# Altium project forwardConverterPCB.PrjPcb (part 2 of 22)
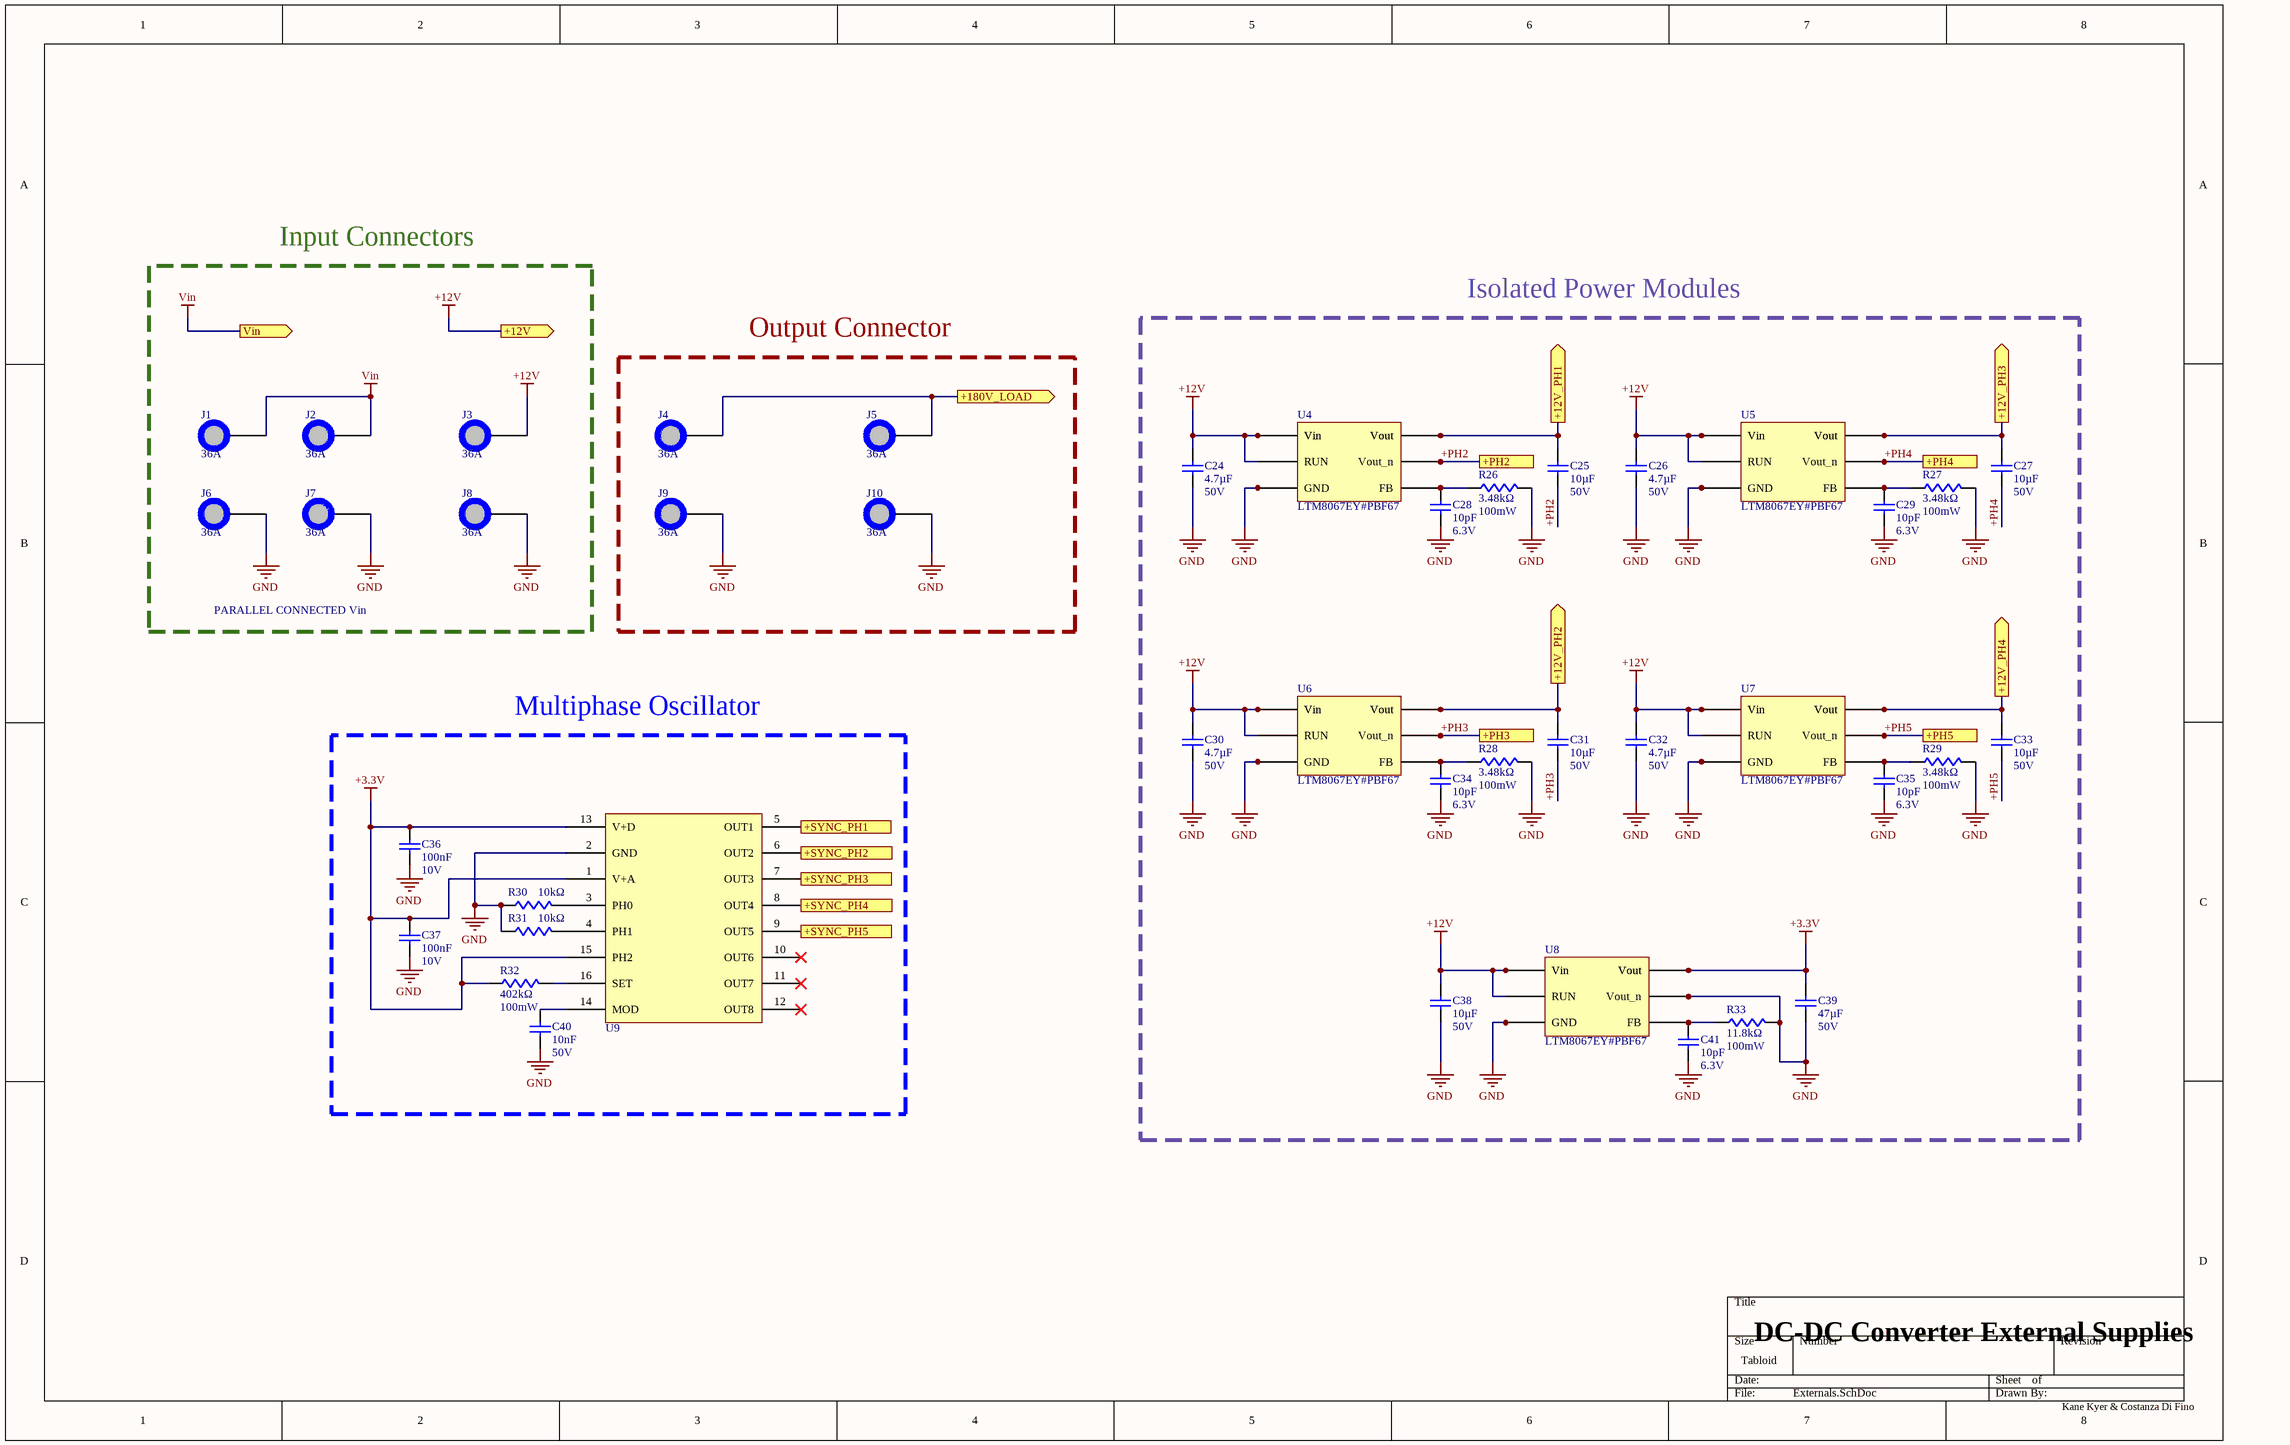
[diagram p7: Externals.SchDoc]

## Sheet Externals.SchDoc (continued)

### Library data of the parts
C24 C26 C30 C32 = GMC31X7R475K50NT: Ceramic Capacitor, Multilayer, Ceramic, 50V, 10% +Tol, 10% -Tol, X7R, 15% TC, 4.7uF, Surface Mount, 1206; Manufacturer: Cal-Chip Electronics; Supplier: DigiKey; Supplier Part Number: 4713-GMC31X7R475K50NTCT-ND; Manufacturer Part Number: GMC31X7R475K50NT; RoHS: Compliant; Category: Ceramic Capacitors; Stock: 34176; Pricing: 1=0.3, 10=0.176, 50=0.128, 100=0.1133, 500=0.08864, 1000=0.08105 (USD); China RoHS: Compliant; Country of Origin: Slovenia, South Korea, Taiwan; Dielectric Material: Ceramic; Export Control Classification Number (ECCN) Code: EAR99; Height: 1.9mm; Harmonized Tariff Schedule (HTS) Code: 8532.24.00.20; Introduction Date: 2018-03-20; Length: 3.2mm; Lifecycle Status: Production; Max Operating Temperature: 125°C; Min Operating Temperature: -55°C; Mounting Technology: Surface Mount; Number of Terminals: 2; REACH SVHC: Yes; Width: 1.6mm; ComponentLink1URL: https://datasheet.octopart.com:443/GMC31X7R475K50NT-Cal-Chip-Electronics-datasheet-182028815.pdf?src-supplier=IHS; ComponentLink1Description: https://datasheet.octopart.com:443/GMC31X7R475K50NT-Cal-Chip-Electronics-datasheet-182028815.pdf?src-supplier=IHS
C25 C27 C31 C33 C38 = CL31B106KBHNNNE: 50V 10uF X7R ±10% 1206 Multilayer Ceramic Capacitors MLCC - SMD/SMT ROHS; Manufacturer: Samsung Electro-Mechanics; Supplier: DigiKey; Supplier Part Number: 1276-6767-1-ND; Manufacturer Part Number: CL31B106KBHNNNE; RoHS: Compliant; Category: Ceramic Capacitors; Stock: 3803783; Pricing: 1=0.35, 10=0.21, 50=0.1536, 100=0.1364, 500=0.10736, 1000=0.09841, 2000=0.09105, 4000=0.085, 6000=0.08196, 10000=0.07861, 14000=0.07664, 20000=0.07476, 24000=0.07386, 48000=0.07085, 50000=0.07069 (USD); Case/Package: 1206; Case Code (Imperial): 1206; Case Code (Metric): 3216; China RoHS: Compliant; Country of Origin: Mainland China, Philippines, South Korea; Dielectric: X7R; Dielectric Material: Ceramic; Export Control Classification Number (ECCN) Code: EAR99; Height: 1.8mm; Harmonized Tariff Schedule (HTS) Code: 8532.24.00.20; Introduction Date: 2014-09-18; Lead Free: Lead Free; Length: 3.2mm; Lifecycle Status: Production; Material: Ceramic; Max Operating Temperature: 125°C; Min Operating Temperature: -55°C; Mounting Technology: Surface Mount; Number of Terminals: 2; Packaging: Tape & Reel (TR); REACH SVHC: Yes; Schedule B: 8532240020, 8532240020|8532240020|8532240020|8532240020|8532240020; Thickness: 1.8034mm; Tolerance: 10%; Voltage Rating (DC): 50V; Width: 1.6mm; ComponentLink1URL: https://datasheet.octopart.com:443/CL31B106KBHNNNE-Samsung-Electro-Mechanics-datasheet-137256395.pdf?src-supplier=Upverter; ComponentLink1Description: https://datasheet.octopart.com:443/CL31B106KBHNNNE-Samsung-Electro-Mechanics-datasheet-137256395.pdf?src-supplier=Upverter; ComponentLink2URL: https://datasheet.octopart.com:443/CL31B106KBHNNNE-Samsung-Electro-Mechanics-datasheet-149066874.pdf?src-supplier=Future+Electronics; ComponentLink2Description: https://datasheet.octopart.com:443/CL31B106KBHNNNE-Samsung-Electro-Mechanics-datasheet-149066874.pdf?src-supplier=Future+Electronics; ComponentLink3URL: https://datasheet.octopart.com:443/CL31B106KBHNNNE-Samsung-Electro-Mechanics-datasheet-67374631.pdf?src-supplier=Future+Electronics; ComponentLink3Description: https://datasheet.octopart.com:443/CL31B106KBHNNNE-Samsung-Electro-Mechanics-datasheet-67374631.pdf?src-supplier=Future+Electronics; ComponentLink4URL: https://datasheet.octopart.com:443/CL31B106KBHNNNE-Samsung-Electro-Mechanics-datasheet-136482622.pdf?src-supplier=Newark; ComponentLink4Description: https://datasheet.octopart.com:443/CL31B106KBHNNNE-Samsung-Electro-Mechanics-datasheet-136482622.pdf?src-supplier=Newark; ComponentLink5URL: https://datasheet.octopart.com/CL31B106KBHNNNE-Samsung-Electro-Mechanics-datasheet-97040617.pdf; ComponentLink5Description: https://datasheet.octopart.com/CL31B106KBHNNNE-Samsung-Electro-Mechanics-datasheet-97040617.pdf; ComponentLink6URL: https://datasheet.octopart.com/CL31B106KBHNNNE-Samsung-Electro-Mechanics-datasheet-8324245.pdf; ComponentLink6Description: https://datasheet.octopart.com/CL31B106KBHNNNE-Samsung-Electro-Mechanics-datasheet-8324245.pdf; ComponentLink7URL: https://datasheet.octopart.com:443/CL31B106KBHNNNE-Samsung-Electro-Mechanics-datasheet-110617700.pdf?src-supplier=LCSC; ComponentLink7Description: https://datasheet.octopart.com:443/CL31B106KBHNNNE-Samsung-Electro-Mechanics-datasheet-110617700.pdf?src-supplier=LCSC; ComponentLink8URL: https://datasheet.octopart.com:443/CL31B106KBHNNNE-Samsung-datasheet-59220082.pdf?src-supplier=TME; ComponentLink8Description: https://datasheet.octopart.com:443/CL31B106KBHNNNE-Samsung-datasheet-59220082.pdf?src-supplier=TME
C28 C29 C34 C35 C41 = 04026A100KAT2A: 0402 10 pF 6.3 V ±10 % Tolerance C0G/NP0 SMT Multilayer Ceramic Capacitor; Manufacturer: KYOCERA AVX; Dielectric: C0G; Tolerance: 10%; Supplier: DigiKey; Supplier Part Number: 478-12646-1-ND; Manufacturer Part Number: 04026A100KAT2A; RoHS: Compliant; Category: Ceramic Capacitors; Stock: 167173; Pricing: 1=0.1, 10=0.028, 50=0.0186, 100=0.0158, 500=0.01114, 1000=0.00972, 2500=0.00824, 5000=0.00734 (USD); Case/Package: 0402; Case Code (Imperial): 0402; Case Code (Metric): 1005; China RoHS: Compliant; Depth: 500µm; Dielectric Material: Ceramic; Export Control Classification Number (ECCN) Code: EAR99; Harmonized Tariff Schedule (HTS) Code: 8532.24.00.20; Introduction Date: 2013-12-18; Lead Free: Lead Free; Length: 1mm; Lifecycle Status: Production; Max Operating Temperature: 125°C; Min Operating Temperature: -55°C; Mounting Technology: Surface Mount; Pins: 2; Number of Terminals: 2; REACH SVHC: Yes; Schedule B: 8532240020; Termination: SMD/SMT; Thickness: 558.8µm; Voltage Rating (DC): 6.3V; Width: 508µm; ComponentLink1URL: https://datasheet.octopart.com:443/04026A100KAT2A-KYOCERA-AVX-datasheet-24569845.pdf?src-supplier=Newark; ComponentLink1Description: https://datasheet.octopart.com:443/04026A100KAT2A-KYOCERA-AVX-datasheet-24569845.pdf?src-supplier=Newark; ComponentLink2URL: https://datasheet.octopart.com:443/04026A100KAT2A-KYOCERA-AVX-datasheet-65568165.pdf?src-supplier=Newark; ComponentLink2Description: https://datasheet.octopart.com:443/04026A100KAT2A-KYOCERA-AVX-datasheet-65568165.pdf?src-supplier=Newark; ComponentLink3URL: https://datasheet.octopart.com:443/04026A100KAT2A-AVX-Interconnect---Elco-datasheet-9883399.pdf?src-supplier=Newark; ComponentLink3Description: https://datasheet.octopart.com:443/04026A100KAT2A-AVX-Interconnect---Elco-datasheet-9883399.pdf?src-supplier=Newark; ComponentLink4URL: https://datasheet.octopart.com:443/04026A100KAT2A-AVX-Interconnect---Elco-datasheet-8446347.pdf?src-supplier=Newark; ComponentLink4Description: https://datasheet.octopart.com:443/04026A100KAT2A-AVX-Interconnect---Elco-datasheet-8446347.pdf?src-supplier=Newark; ComponentLink5URL: https://datasheet.octopart.com:443/04026A100KAT2A-AVX-Interconnect---Elco-datasheet-167032.pdf?src-supplier=Newark; ComponentLink5Description: https://datasheet.octopart.com:443/04026A100KAT2A-AVX-Interconnect---Elco-datasheet-167032.pdf?src-supplier=Newark; ComponentLink6URL: https://datasheet.octopart.com:443/04026A100KAT2A-KYOCERA-AVX-datasheet-50865065.pdf?src-supplier=Future+Electronics; ComponentLink6Description: https://datasheet.octopart.com:443/04026A100KAT2A-KYOCERA-AVX-datasheet-50865065.pdf?src-supplier=Future+Electronics; ComponentLink7URL: https://datasheet.octopart.com/04026A100KAT2A-AVX---Kyocera-datasheet-13516023.pdf; ComponentLink7Description: https://datasheet.octopart.com/04026A100KAT2A-AVX---Kyocera-datasheet-13516023.pdf; ComponentLink8URL: http://sigma.octopart.com:80/rohs_statement/Commercial-Surface-Mount-Chips---C0G-NP0-Dielectric-AVX-family-181.pdf?src-supplier=Compliance+Statements; ComponentLink8Description: http://sigma.octopart.com:80/rohs_statement/Commercial-Surface-Mount-Chips---C0G-NP0-Dielectric-AVX-family-181.pdf?src-supplier=Compliance+Statements; ComponentLink9URL: http://sigma.octopart.com:80/conflict_mineral_statement/AVX-company-34.pdf?src-supplier=Compliance+Statements; ComponentLink9Description: http://sigma.octopart.com:80/conflict_mineral_statement/AVX-company-34.pdf?src-supplier=Compliance+Statements; ComponentLink10URL: http://sigma.octopart.com:80/reach_statement/AVX-company-19.pdf?src-supplier=Compliance+Statements; ComponentLink10Description: http://sigma.octopart.com:80/reach_statement/AVX-company-19.pdf?src-supplier=Compliance+Statements
C36 C37 = GMC04X7R104K10NT: 10V 100nF X7R ±10% 0402 Multilayer Ceramic Capacitors MLCC - SMD/SMT ROHS; Manufacturer: Cal-Chip Electronics; Supplier: DigiKey; Supplier Part Number: 4713-GMC04X7R104K10NTCT-ND; Manufacturer Part Number: GMC04X7R104K10NT; RoHS: Compliant; Category: Ceramic Capacitors; Stock: 45770; Pricing: 1=0.1, 10=0.016, 50=0.0104, 100=0.0088, 500=0.00608, 1000=0.00524, 2500=0.00436, 5000=0.00384 (USD); China RoHS: Compliant; Country of Origin: Slovenia, South Korea, Taiwan; Dielectric Material: Ceramic; Export Control Classification Number (ECCN) Code: EAR99; Height: 550µm; Harmonized Tariff Schedule (HTS) Code: 8532.24.00.20; Introduction Date: 2006-06-19; Length: 1mm; Lifecycle Status: Production; Max Operating Temperature: 125°C; Min Operating Temperature: -55°C; Mounting Technology: Surface Mount; Number of Terminals: 2; REACH SVHC: Yes; Width: 500µm; ComponentLink1URL: https://datasheet.octopart.com:443/GMC04X7R104K10NT-Cal-Chip-Electronics-datasheet-182028815.pdf?src-supplier=IHS; ComponentLink1Description: https://datasheet.octopart.com:443/GMC04X7R104K10NT-Cal-Chip-Electronics-datasheet-182028815.pdf?src-supplier=IHS
C39 = CKG57NX7R1H476M500JJ: Ceramic Capacitor, Multilayer, Ceramic, 50V, 20% +Tol, 20% -Tol, X7R, 15% TC, 47uF, Surface Mount, 2420; Manufacturer: TDK; Manufacturer Lifecycle Status: PRODUCTION; Supplier: DigiKey; Supplier Part Number: 445-CKG57NX7R1H476M500JJCT-ND; Manufacturer Part Number: CKG57NX7R1H476M500JJ; RoHS: Compliant; Category: Ceramic Capacitors; Stock: 11597; Pricing: 1=9.3, 10=7.032, 50=6.1256, 100=5.845, 500=5.8293 (USD); China RoHS: Compliant; Dielectric Material: Ceramic; Height: 5mm; Length: 6mm; Lifecycle Status: Production; Max Length: 6.5mm; Max Operating Temperature: 125°C; Max Width: 5.5mm; Min Length: 5.5mm; Min Operating Temperature: -55°C; Min Width: 4.5mm; Mounting Technology: Surface Mount; Number of Terminals: 2; REACH SVHC: Yes; Width: 5mm; ComponentLink1URL: https://datasheet.octopart.com:443/CKG57NX7R1H476M500JJ-TDK-datasheet-181961982.pdf?src-supplier=IHS; ComponentLink1Description: https://datasheet.octopart.com:443/CKG57NX7R1H476M500JJ-TDK-datasheet-181961982.pdf?src-supplier=IHS; ComponentLink2URL: https://datasheet.octopart.com:443/CKG57NX7R1H476M500JJ-TDK-datasheet-151651377.pdf?src-supplier=Future+Electronics; ComponentLink2Description: https://datasheet.octopart.com:443/CKG57NX7R1H476M500JJ-TDK-datasheet-151651377.pdf?src-supplier=Future+Electronics; ComponentLink3URL: https://datasheet.octopart.com:443/CKG57NX7R1H476M500JJ-TDK-datasheet-182135362.pdf?src-supplier=TME; ComponentLink3Description: https://datasheet.octopart.com:443/CKG57NX7R1H476M500JJ-TDK-datasheet-182135362.pdf?src-supplier=TME; ComponentLink4URL: https://datasheet.octopart.com:443/CKG57NX7R1H476M500JJ-TDK-datasheet-165812700.pdf?src-supplier=ODG+(Origin+Data+Global); ComponentLink4Description: https://datasheet.octopart.com:443/CKG57NX7R1H476M500JJ-TDK-datasheet-165812700.pdf?src-supplier=ODG+(Origin+Data+Global)
C40 = C0603C103K5RACTU: Capacitor, Multilayer, Ceramic, 50V, 10%, X7R, 15% Tc, 0.01Uf, Surface Mount, 0603; Manufacturer: KEMET; Dissipation Factor: 2.5%; Temperature Coefficient: 30ppm/°C; Supplier: DigiKey; Supplier Part Number: 399-C0603C103K5RACTUCT-ND; Manufacturer Part Number: C0603C103K5RACTU; RoHS: Compliant; Category: Ceramic Capacitors; Stock: 5424360; Pricing: 1=0.08, 10=0.009 (USD); Case/Package: 0603; Case Code (Imperial): 0603; China RoHS: Compliant; Contact Plating: Tin; Country of Origin: Mainland China, Mexico; Depth: 800µm; Dielectric: X7R; Dielectric Material: Ceramic; Export Control Classification Number (ECCN) Code: EAR99; Height: 800µm; Harmonized Tariff Schedule (HTS) Code: 8532.24.00.20; Introduction Date: 2011-07-27; Lead Free: Lead Free; Lead Pitch: 700µm; Length: 1.6mm; Lifecycle Status: Production; Material: Ceramic; Max Operating Temperature: 125°C; Min Operating Temperature: -55°C; Mounting Technology: Surface Mount; Pins: 2; Number of Terminals: 2; Packaging: Cut Tape; Radiation Hardening: No; REACH SVHC: Yes; Schedule B: 8532240020, 8532240020|8532240020, 8532240020|8532240020|8532240020, 8532240020|8532240020|8532240020|8532240020; Termination: SMD/SMT; Thickness: 863.6µm; Tolerance: 10%; Voltage: 50V; Voltage Rating (DC): 50V; Width: 800µm; ComponentLink1URL: https://datasheet.octopart.com:443/C0603C103K5RACTU-KEMET-datasheet-178445679.pdf?src-supplier=Farnell; ComponentLink1Description: https://datasheet.octopart.com:443/C0603C103K5RACTU-KEMET-datasheet-178445679.pdf?src-supplier=Farnell; ComponentLink2URL: https://datasheet.octopart.com:443/C0603C103K5RACTU-KEMET-datasheet-137357759.pdf?src-supplier=Farnell; ComponentLink2Description: https://datasheet.octopart.com:443/C0603C103K5RACTU-KEMET-datasheet-137357759.pdf?src-supplier=Farnell; ComponentLink3URL: https://datasheet.octopart.com:443/C0603C103K5RACTU-KEMET-datasheet-149521831.pdf?src-supplier=Farnell; ComponentLink3Description: https://datasheet.octopart.com:443/C0603C103K5RACTU-KEMET-datasheet-149521831.pdf?src-supplier=Farnell; ComponentLink4URL: https://datasheet.octopart.com:443/C0603C103K5RAC-TU-Kemet-datasheet-12608295.pdf?src-supplier=Farnell; ComponentLink4Description: https://datasheet.octopart.com:443/C0603C103K5RAC-TU-Kemet-datasheet-12608295.pdf?src-supplier=Farnell; ComponentLink5URL: https://datasheet.octopart.com:443/C0603C103K5RAC-TU-Kemet-datasheet-11992184.pdf?src-supplier=Farnell; ComponentLink5Description: https://datasheet.octopart.com:443/C0603C103K5RAC-TU-Kemet-datasheet-11992184.pdf?src-supplier=Farnell; ComponentLink6URL: https://datasheet.octopart.com:443/C0603C103K5RAC-TU-Kemet-datasheet-10942409.pdf?src-supplier=Farnell; ComponentLink6Description: https://datasheet.octopart.com:443/C0603C103K5RAC-TU-Kemet-datasheet-10942409.pdf?src-supplier=Farnell; ComponentLink7URL: https://datasheet.octopart.com:443/C0603C103K5RAC-TU-Kemet-datasheet-10404442.pdf?src-supplier=Farnell; ComponentLink7Description: https://datasheet.octopart.com:443/C0603C103K5RAC-TU-Kemet-datasheet-10404442.pdf?src-supplier=Farnell; ComponentLink8URL: https://datasheet.octopart.com:443/C0603C103K5RACTU-KEMET-datasheet-101575646.pdf?src-supplier=Farnell; ComponentLink8Description: https://datasheet.octopart.com:443/C0603C103K5RACTU-KEMET-datasheet-101575646.pdf?src-supplier=Farnell; ComponentLink9URL: https://datasheet.octopart.com:443/C0603C103K5RACTU.-Kemet-datasheet-41232427.pdf?src-supplier=Farnell; ComponentLink9Description: https://datasheet.octopart.com:443/C0603C103K5RACTU.-Kemet-datasheet-41232427.pdf?src-supplier=Farnell; ComponentLink10URL: https://datasheet.octopart.com:443/C0603C103K5RACTU-KEMET-datasheet-176142155.pdf?src-supplier=Farnell; ComponentLink10Description: https://datasheet.octopart.com:443/C0603C103K5RACTU-KEMET-datasheet-176142155.pdf?src-supplier=Farnell; ComponentLink11URL: https://datasheet.octopart.com:443/C0603C103K5RAC-TU-Kemet-datasheet-7833651.pdf?src-supplier=Farnell; ComponentLink11Description: https://datasheet.octopart.com:443/C0603C103K5RAC-TU-Kemet-datasheet-7833651.pdf?src-supplier=Farnell; ComponentLink12URL: https://datasheet.octopart.com:443/C0603C103K5RAC-TU-Kemet-datasheet-7601896.pdf?src-supplier=Farnell; ComponentLink12Description: https://datasheet.octopart.com:443/C0603C103K5RAC-TU-Kemet-datasheet-7601896.pdf?src-supplier=Farnell; ComponentLink13URL: https://datasheet.octopart.com:443/C0603C103K5RAC-TU-Kemet-datasheet-5316294.pdf?src-supplier=Farnell; ComponentLink13Description: https://datasheet.octopart.com:443/C0603C103K5RAC-TU-Kemet-datasheet-5316294.pdf?src-supplier=Farnell; ComponentLink14URL: https://datasheet.octopart.com:443/C0603C103K5RAC-TU-Kemet-datasheet-5314837.pdf?src-supplier=Farnell; ComponentLink14Description: https://datasheet.octopart.com:443/C0603C103K5RAC-TU-Kemet-datasheet-5314837.pdf?src-supplier=Farnell; ComponentLink15URL: https://datasheet.octopart.com:443/C0603C103K5RAC-TU-Kemet-datasheet-8092359.pdf?src-supplier=Farnell; ComponentLink15Description: https://datasheet.octopart.com:443/C0603C103K5RAC-TU-Kemet-datasheet-8092359.pdf?src-supplier=Farnell; ComponentLink16URL: https://datasheet.octopart.com:443/C0603C103K5RACTU-Kemet-datasheet-5314449.pdf?src-supplier=Farnell; ComponentLink16Description: https://datasheet.octopart.com:443/C0603C103K5RACTU-Kemet-datasheet-5314449.pdf?src-supplier=Farnell; ComponentLink17URL: https://datasheet.octopart.com:443/C0603C103K5RAC-TU-Kemet-datasheet-5390537.pdf?src-supplier=Farnell; ComponentLink17Description: https://datasheet.octopart.com:443/C0603C103K5RAC-TU-Kemet-datasheet-5390537.pdf?src-supplier=Farnell; ComponentLink18URL: https://datasheet.octopart.com:443/C0603C103K5RAC-TU-Kemet-datasheet-5314969.pdf?src-supplier=Farnell; ComponentLink18Description: https://datasheet.octopart.com:443/C0603C103K5RAC-TU-Kemet-datasheet-5314969.pdf?src-supplier=Farnell; ComponentLink19URL: https://datasheet.octopart.com:443/C0603C103K5RAC-TU-Kemet-datasheet-5314627.pdf?src-supplier=Farnell; ComponentLink19Description: https://datasheet.octopart.com:443/C0603C103K5RAC-TU-Kemet-datasheet-5314627.pdf?src-supplier=Farnell; ComponentLink20URL: https://datasheet.octopart.com:443/C0603C103K5RAC-TU-Kemet-datasheet-5389132.pdf?src-supplier=Farnell; ComponentLink20Description: https://datasheet.octopart.com:443/C0603C103K5RAC-TU-Kemet-datasheet-5389132.pdf?src-supplier=Farnell; ComponentLink21URL: https://datasheet.octopart.com:443/C0603C103K5RAC-TU-Kemet-datasheet-5313836.pdf?src-supplier=Farnell; ComponentLink21Description: https://datasheet.octopart.com:443/C0603C103K5RAC-TU-Kemet-datasheet-5313836.pdf?src-supplier=Farnell; ComponentLink22URL: https://datasheet.octopart.com:443/C0603C103K5RAC-TU-Kemet-datasheet-8111010.pdf?src-supplier=Farnell; ComponentLink22Description: https://datasheet.octopart.com:443/C0603C103K5RAC-TU-Kemet-datasheet-8111010.pdf?src-supplier=Farnell; ComponentLink23URL: https://datasheet.octopart.com:443/C0603C103K5RAC-TU-Kemet-datasheet-7541751.pdf?src-supplier=Farnell; ComponentLink23Description: https://datasheet.octopart.com:443/C0603C103K5RAC-TU-Kemet-datasheet-7541751.pdf?src-supplier=Farnell; ComponentLink24URL: https://datasheet.octopart.com:443/C0603C103K5RAC-TU-Kemet-datasheet-7627733.pdf?src-supplier=Farnell; ComponentLink24Description: https://datasheet.octopart.com:443/C0603C103K5RAC-TU-Kemet-datasheet-7627733.pdf?src-supplier=Farnell; ComponentLink25URL: https://datasheet.octopart.com:443/C0603C103K5RAC-TU-Kemet-datasheet-5315946.pdf?src-supplier=Farnell; ComponentLink25Description: https://datasheet.octopart.com:443/C0603C103K5RAC-TU-Kemet-datasheet-5315946.pdf?src-supplier=Farnell; ComponentLink26URL: https://datasheet.octopart.com:443/C0603C103K5RAC7867-KEMET-datasheet-182039592.pdf?src-supplier=JRH+Electronics; ComponentLink26Description: https://datasheet.octopart.com:443/C0603C103K5RAC7867-KEMET-datasheet-182039592.pdf?src-supplier=JRH+Electronics; ComponentLink27URL: https://datasheet.octopart.com:443/C0603C103K5RACTU-KEMET-datasheet-137357764.pdf?src-supplier=Upverter; ComponentLink27Description: https://datasheet.octopart.com:443/C0603C103K5RACTU-KEMET-datasheet-137357764.pdf?src-supplier=Upverter; ComponentLink28URL: https://datasheet.octopart.com:443/C0603C103K5RAC7867-KEMET-datasheet-188512054.pdf?src-supplier=ODG+(Origin+Data+Global); ComponentLink28Description: https://datasheet.octopart.com:443/C0603C103K5RAC7867-KEMET-datasheet-188512054.pdf?src-supplier=ODG+(Origin+Data+Global); ComponentLink29URL: https://datasheet.octopart.com:443/C0603C103K5RACTU-Kemet-datasheet-5313890.pdf?src-supplier=element14; ComponentLink29Description: https://datasheet.octopart.com:443/C0603C103K5RACTU-Kemet-datasheet-5313890.pdf?src-supplier=element14; ComponentLink30URL: https://datasheet.octopart.com:443/C0603C103K5RACTU-KEMET-datasheet-157246124.pdf?src-supplier=Electro+Sonic; ComponentLink30Description: https://datasheet.octopart.com:443/C0603C103K5RACTU-KEMET-datasheet-157246124.pdf?src-supplier=Electro+Sonic; ComponentLink31URL: https://datasheet.octopart.com:443/C0603C103K5RACTU-KEMET-datasheet-32036385.pdf?src-supplier=Electro+Sonic; ComponentLink31Description: https://datasheet.octopart.com:443/C0603C103K5RACTU-KEMET-datasheet-32036385.pdf?src-supplier=Electro+Sonic; ComponentLink32URL: https://datasheet.octopart.com:443/C0603C103K5RACTU-KEMET-datasheet-176142164.pdf?src-supplier=Newark; ComponentLink32Description: https://datasheet.octopart.com:443/C0603C103K5RACTU-KEMET-datasheet-176142164.pdf?src-supplier=Newark; ComponentLink33URL: https://datasheet.octopart.com:443/C0603C103K5RACTU-Kemet-datasheet-27203261.pdf?src-supplier=Newark; ComponentLink33Description: https://datasheet.octopart.com:443/C0603C103K5RACTU-Kemet-datasheet-27203261.pdf?src-supplier=Newark; ComponentLink34URL: https://datasheet.octopart.com:443/C0603C103K5RACTU-KEMET-datasheet-164512540.pdf?src-supplier=TME; ComponentLink34Description: https://datasheet.octopart.com:443/C0603C103K5RACTU-KEMET-datasheet-164512540.pdf?src-supplier=TME; ComponentLink35URL: https://datasheet.octopart.com:443/C0603C103K5RACTU-KEMET-datasheet-81639432.pdf?src-supplier=TME; ComponentLink35Description: https://datasheet.octopart.com:443/C0603C103K5RACTU-KEMET-datasheet-81639432.pdf?src-supplier=TME; ComponentLink36URL: https://datasheet.octopart.com:443/C0603C103K5RACTU-KEMET-datasheet-68331906.pdf?src-supplier=TME; ComponentLink36Description: https://datasheet.octopart.com:443/C0603C103K5RACTU-KEMET-datasheet-68331906.pdf?src-supplier=TME; ComponentLink37URL: https://datasheet.octopart.com:443/C0603C103K5RACTU-KEMET-datasheet-110724412.pdf?src-supplier=RS+(Formerly+Allied+Electronics); ComponentLink37Description: https://datasheet.octopart.com:443/C0603C103K5RACTU-KEMET-datasheet-110724412.pdf?src-supplier=RS+(Formerly+Allied+Electronics); ComponentLink38URL: https://datasheet.octopart.com:443/C0603C103K5RACTU-Kemet-datasheet-464.pdf?src-supplier=RS+(Formerly+Allied+Electronics); ComponentLink38Description: https://datasheet.octopart.com:443/C0603C103K5RACTU-Kemet-datasheet-464.pdf?src-supplier=RS+(Formerly+Allied+Electronics); ComponentLink39URL: https://datasheet.octopart.com/C0603C103K5RACTU-KEMET-datasheet-84169754.pdf; ComponentLink39Description: https://datasheet.octopart.com/C0603C103K5RACTU-KEMET-datasheet-84169754.pdf; ComponentLink40URL: https://datasheet.octopart.com:443/C0603C103K5RACTU-Kemet-datasheet-22084244.pdf?src-supplier=element14+APAC; ComponentLink40Description: https://datasheet.octopart.com:443/C0603C103K5RACTU-Kemet-datasheet-22084244.pdf?src-supplier=element14+APAC; ComponentLink41URL: https://datasheet.octopart.com:443/C0603C103K5RACTU-Kemet-datasheet-11898999.pdf?src-supplier=Arrow+Electronics; ComponentLink41Description: https://datasheet.octopart.com:443/C0603C103K5RACTU-Kemet-datasheet-11898999.pdf?src-supplier=Arrow+Electronics; ComponentLink42URL: https://datasheet.octopart.com:443/C0603C103K5RAC7867-KEMET-datasheet-164857143.pdf?src-supplier=Burklin+Elektronik; ComponentLink42Description: https://datasheet.octopart.com:443/C0603C103K5RAC7867-KEMET-datasheet-164857143.pdf?src-supplier=Burklin+Elektronik
J1-J10 = SMTSO-116-8ET: ReelFast Surface Mount Nuts and Spacers/Standoffs -br Type SMTSO - Unified; Manufacturer: PennEngineering; Supplier: Mouser; Supplier Part Number: 153-SMTSO-116-8ET; Manufacturer Part Number: SMTSO-116-8ET; Category: Uncategorized; Stock: 8529; Pricing: 1=1.02, 10=0.764, 50=0.764, 100=0.595, 1000=0.561, 10000=0.494 (USD); Country of Origin: Ireland, Mainland China, USA; Export Control Classification Number (ECCN) Code: EAR99; Introduction Date: 2014-03-13; RoHS: Non-Compliant
R26-R29 = RM06F3481CT: Fixed Resistor, Metal Glaze/thick Film, 0.1W, 3480ohm, 75V, 1% +/-Tol, Surface Mount, 0603; Manufacturer: Cal-Chip Electronics; Temperature Coefficient: 100ppm/°C; Supplier: DigiKey; Supplier Part Number: 4713-RM06F3481CT-ND; Manufacturer Part Number: RM06F3481CT; RoHS: Compliant; Category: Chip SMD Resistors; Stock: 4650; Pricing: 1=0.1, 10=0.023, 25=0.0168, 50=0.0134, 100=0.0108, 250=0.00832, 500=0.00692, 1000=0.00583 (USD); China RoHS: Non-Compliant; Height: 450µm; Lifecycle Status: Production; Max Operating Temperature: 155°C; Min Operating Temperature: -55°C; Mounting Technology: Surface Mount; Number of Terminals: 2; REACH SVHC: Yes; Tolerance: 1%; Width: 800µm; Working Voltage: 75V; ComponentLink1URL: https://datasheet.octopart.com:443/RM06F3481CT-Cal-Chip-Electronics-datasheet-182142084.pdf?src-supplier=IHS; ComponentLink1Description: https://datasheet.octopart.com:443/RM06F3481CT-Cal-Chip-Electronics-datasheet-182142084.pdf?src-supplier=IHS
R30 R31 = RM04F1002CT: Fixed Resistor, Metal Glaze/thick Film, 0.0625W, 10000ohm, 50V, 1% +/-Tol, Surface Mount, 0402; Manufacturer: Cal-Chip Electronics; Power Dissipation: 62.5mW; Temperature Coefficient: 100ppm/°C; Power Rating: 63mW; Supplier: DigiKey; Supplier Part Number: 4713-RM04F1002CT-ND; Manufacturer Part Number: RM04F1002CT; RoHS: Compliant; Category: Chip SMD Resistors; Stock: 357132; Pricing: 1=0.1, 10=0.015, 25=0.0108, 50=0.0086, 100=0.0068, 250=0.00512, 500=0.00418, 1000=0.00345, 5000=0.00232 (USD); Case/Package: 0402; China RoHS: Non-Compliant; Composition: Thick Film; Country of Origin: Slovenia, South Korea, Taiwan; Export Control Classification Number (ECCN) Code: EAR99; Height: 350µm; Harmonized Tariff Schedule (HTS) Code: 8533.21.00.30; Introduction Date: 1999-11-02; Lifecycle Status: Production; Max Operating Temperature: 155°C; Min Operating Temperature: -55°C; Mounting Technology: Surface Mount; Number of Terminals: 2; REACH SVHC: Yes; Tolerance: 1%; Voltage Rating: 50V; Width: 500µm; Working Voltage: 50V; ComponentLink1URL: https://datasheet.octopart.com:443/RM04F1002CT-Cal-Chip-Electronics-datasheet-182142084.pdf?src-supplier=IHS; ComponentLink1Description: https://datasheet.octopart.com:443/RM04F1002CT-Cal-Chip-Electronics-datasheet-182142084.pdf?src-supplier=IHS; ComponentLink2URL: https://datasheet.octopart.com:443/RM04F1002CT-Cal-Chip-Electronics-datasheet-159083027.pdf?src-supplier=Upverter; ComponentLink2Description: https://datasheet.octopart.com:443/RM04F1002CT-Cal-Chip-Electronics-datasheet-159083027.pdf?src-supplier=Upverter
R32 = RC0603FR-07402KL: 100mW Thick Film Resistors 75V ±100ppm/℃ ±1% 402kΩ 0603 Chip Resistor - Surface Mount ROHS; Manufacturer: Yageo Group; Temperature Coefficient: 100ppm/°C; Voltage Rating (DC): 50V; Supplier: DigiKey; Supplier Part Number: 311-402KHRCT-ND; Manufacturer Part Number: RC0603FR-07402KL; RoHS: Compliant; Category: Chip SMD Resistors; Stock: 1107720; Pricing: 1=0.1, 10=0.006, 25=0.0056, 5000=0.00204 (USD); Case/Package: 0603; Case Code (Imperial): 0603; China RoHS: Non-Compliant; Composition: Thick Film; Country of Origin: Mainland China, Taiwan; Depth: 800µm; Export Control Classification Number (ECCN) Code: EAR99; Features: Moisture Resistant; Height: 450µm; Harmonized Tariff Schedule (HTS) Code: 8533.21.00.30; Introduction Date: 2004-09-22; Lead Free: Lead Free; Length: 1.6mm; Lifecycle Status: Production; Max Operating Temperature: 155°C; Max Power Dissipation: 100mW; Military Standard: Not; Min Operating Temperature: -55°C; Mounting Technology: Surface Mount; Number of Terminals: 2; Number of Terminations: 2; Packaging: Tape & Reel; Power Rating: 100mW; REACH SVHC: Yes; Schedule B: 8533210045, 8533210045|8533210045, 8533210045|8533210045|8533210045, 8533210045|8533210045|8533210045|8533210045; Termination: SMD/SMT; Tolerance: 1%; Voltage Rating: 75V; Weight: 2.012816mg; Width: 800µm; Working Voltage: 75V; ComponentLink1URL: https://datasheet.octopart.com:443/RC0603FR-07402KL-Yageo-datasheet-175887523.pdf?src-supplier=Newark; ComponentLink1Description: https://datasheet.octopart.com:443/RC0603FR-07402KL-Yageo-datasheet-175887523.pdf?src-supplier=Newark; ComponentLink2URL: https://datasheet.octopart.com:443/RC0603FR-07402KL-Yageo-datasheet-103092701.pdf?src-supplier=Upverter; ComponentLink2Description: https://datasheet.octopart.com:443/RC0603FR-07402KL-Yageo-datasheet-103092701.pdf?src-supplier=Upverter; ComponentLink3URL: https://datasheet.octopart.com:443/RC0603FR-07402KL-Yageo-Group-datasheet-176638170.pdf?src-supplier=Future+Electronics; ComponentLink3Description: https://datasheet.octopart.com:443/RC0603FR-07402KL-Yageo-Group-datasheet-176638170.pdf?src-supplier=Future+Electronics; ComponentLink4URL: https://datasheet.octopart.com:443/RC0603FR-07402KL-Yageo-datasheet-164759695.pdf?src-supplier=Future+Electronics; ComponentLink4Description: https://datasheet.octopart.com:443/RC0603FR-07402KL-Yageo-datasheet-164759695.pdf?src-supplier=Future+Electronics; ComponentLink5URL: https://datasheet.octopart.com:443/RC0603FR-07402KL-Yageo-datasheet-137700087.pdf?src-supplier=Future+Electronics; ComponentLink5Description: https://datasheet.octopart.com:443/RC0603FR-07402KL-Yageo-datasheet-137700087.pdf?src-supplier=Future+Electronics; ComponentLink6URL: https://datasheet.octopart.com:443/RC0603FR-07402KL-Yageo-datasheet-17842380.pdf?src-supplier=Future+Electronics; ComponentLink6Description: https://datasheet.octopart.com:443/RC0603FR-07402KL-Yageo-datasheet-17842380.pdf?src-supplier=Future+Electronics; ComponentLink7URL: https://datasheet.octopart.com:443/RC0603FR-07402KL-Yageo-datasheet-15599030.pdf?src-supplier=Future+Electronics; ComponentLink7Description: https://datasheet.octopart.com:443/RC0603FR-07402KL-Yageo-datasheet-15599030.pdf?src-supplier=Future+Electronics; ComponentLink8URL: https://datasheet.octopart.com:443/RC0603FR-07402KL-Yageo-datasheet-12596169.pdf?src-supplier=Future+Electronics; ComponentLink8Description: https://datasheet.octopart.com:443/RC0603FR-07402KL-Yageo-datasheet-12596169.pdf?src-supplier=Future+Electronics; ComponentLink9URL: https://datasheet.octopart.com:443/RC0603FR-07402KL-Yageo-datasheet-8328172.pdf?src-supplier=Future+Electronics; ComponentLink9Description: https://datasheet.octopart.com:443/RC0603FR-07402KL-Yageo-datasheet-8328172.pdf?src-supplier=Future+Electronics; ComponentLink10URL: https://datasheet.octopart.com/RC0603FR-07402KL-Yageo-datasheet-73766026.pdf; ComponentLink10Description: https://datasheet.octopart.com/RC0603FR-07402KL-Yageo-datasheet-73766026.pdf; ComponentLink11URL: https://datasheet.octopart.com:443/RC0603FR-07402KL-Yageo-datasheet-118562.pdf?src-supplier=DigiKey; ComponentLink11Description: https://datasheet.octopart.com:443/RC0603FR-07402KL-Yageo-datasheet-118562.pdf?src-supplier=DigiKey; ComponentLink12URL: http://sigma.octopart.com:80/conflict_mineral_statement/Yageo-company-3.pdf?src-supplier=Compliance+Statements; ComponentLink12Description: http://sigma.octopart.com:80/conflict_mineral_statement/Yageo-company-3.pdf?src-supplier=Compliance+Statements; ComponentLink13URL: http://sigma.octopart.com:80/rohs_statement/Yageo-company-2.pdf?src-supplier=Compliance+Statements; ComponentLink13Description: http://sigma.octopart.com:80/rohs_statement/Yageo-company-2.pdf?src-supplier=Compliance+Statements
R33 = RK73H1JTTD1182F: Res Thick Film 0603 11.8K Ohm 1% 0.1W(1/10W) ±100ppm/C Pad SMD Automotive T/R; Manufacturer: KOA Speer; Temperature Coefficient: 100ppm/°C; Voltage Rating: 75V; Voltage Rating (DC): 50V; Supplier: DigiKey; Supplier Part Number: 2019-RK73H1JTTD1182FCT-ND; Manufacturer Part Number: RK73H1JTTD1182F; RoHS: Compliant; Category: Chip SMD Resistors; Stock: 138151; Pricing: 1=0.1, 10=0.026, 25=0.0188, 50=0.0152, 100=0.0124, 250=0.0096, 500=0.00802, 1000=0.0068 (USD); Case/Package: 0603; Case Code (Imperial): 0603; Case Code (Metric): 1608; China RoHS: Non-Compliant; Composition: Thick Film; Country of Origin: Japan; Depth: 800µm; Export Control Classification Number (ECCN) Code: EAR99; Height: 450µm; Harmonized Tariff Schedule (HTS) Code: 8533.21.00.30; Introduction Date: 2002-06-01; Lead Free: Lead Free; Length: 1.6mm; Lifecycle Status: Production; Max Operating Temperature: 155°C; Military Standard: Not; Min Operating Temperature: -55°C; Mounting Technology: Surface Mount; Number of Terminals: 2; Power Rating: 100mW; REACH SVHC: Yes; Schedule B: 8533210045, 8533210045|8533210045, 8533210045|8533210045|8533210045, 8533210045|8533210045|8533210045|8533210045; Termination: SMD/SMT; Tolerance: 1%; Width: 800µm; Working Voltage: 75V; ComponentLink1URL: https://datasheet.octopart.com:443/RK73H1JTTD1182F-KOA-Speer-datasheet-181956035.pdf?src-supplier=IHS; ComponentLink1Description: https://datasheet.octopart.com:443/RK73H1JTTD1182F-KOA-Speer-datasheet-181956035.pdf?src-supplier=IHS; ComponentLink2URL: https://datasheet.octopart.com:443/RK73H1JTTD1182F-KOA-Speer-datasheet-11590619.pdf?src-supplier=Upverter; ComponentLink2Description: https://datasheet.octopart.com:443/RK73H1JTTD1182F-KOA-Speer-datasheet-11590619.pdf?src-supplier=Upverter; ComponentLink3URL: https://datasheet.octopart.com:443/RK73H1JTTD1182F-KOA-Speer-datasheet-149653815.pdf?src-supplier=element14+APAC; ComponentLink3Description: https://datasheet.octopart.com:443/RK73H1JTTD1182F-KOA-Speer-datasheet-149653815.pdf?src-supplier=element14+APAC; ComponentLink4URL: https://datasheet.octopart.com:443/RK73H1JTTD1182F-KOA-Speer-datasheet-188906116.pdf?src-supplier=TME; ComponentLink4Description: https://datasheet.octopart.com:443/RK73H1JTTD1182F-KOA-Speer-datasheet-188906116.pdf?src-supplier=TME; ComponentLink5URL: https://datasheet.octopart.com:443/RK73H1JTTD1182F-KOA-Speer-datasheet-11541643.pdf?src-supplier=Arrow+Electronics; ComponentLink5Description: https://datasheet.octopart.com:443/RK73H1JTTD1182F-KOA-Speer-datasheet-11541643.pdf?src-supplier=Arrow+Electronics; ComponentLink6URL: https://datasheet.octopart.com:443/RK73H1JTTD1182F-KOA-Speer-datasheet-5377369.pdf?src-supplier=Garrett; ComponentLink6Description: https://datasheet.octopart.com:443/RK73H1JTTD1182F-KOA-Speer-datasheet-5377369.pdf?src-supplier=Garrett; ComponentLink7URL: https://datasheet.octopart.com:443/RK73H1JTTD1182F-KOA-Speer-datasheet-5377256.pdf?src-supplier=Garrett; ComponentLink7Description: https://datasheet.octopart.com:443/RK73H1JTTD1182F-KOA-Speer-datasheet-5377256.pdf?src-supplier=Garrett; ComponentLink8URL: https://datasheet.octopart.com:443/RK73H1JTTD1182F-KOA-Speer-datasheet-109233.pdf?src-supplier=Garrett; ComponentLink8Description: https://datasheet.octopart.com:443/RK73H1JTTD1182F-KOA-Speer-datasheet-109233.pdf?src-supplier=Garrett; ComponentLink9URL: http://sigma.octopart.com:80/rohs_statement/KOA-Speer-company-17.pdf?src-supplier=Compliance+Statements; ComponentLink9Description: http://sigma.octopart.com:80/rohs_statement/KOA-Speer-company-17.pdf?src-supplier=Compliance+Statements
U4-U8 = LTM8067EY#PBF: Module DC-DC 1-OUT 2.5V to 24V 0.45A 2.5W 38-Pin BGA Tray; Manufacturer: Analog Devices; Manufacturer Lifecycle Status: PRODUCTION; Isolation Voltage: 2kV; Max Supply Voltage: 40V; Max Junction Temperature (Tj): 125°C; Max Output current: 450mA; Min Input Voltage: 2.8V; Min Supply Voltage: 3V; Nominal Supply Current: 7mA; Number of Outputs: 1; Topology: Flyback; Supplier: DigiKey; Supplier Part Number: 505-LTM8067EY#PBF-ND; RoHS: Compliant; Category: Board Mount Modules; Stock: 1604; Pricing: 1=25.3, 5=24.36, 10=23.965, 25=23.4524, 50=23.0708, 168=22.4178, 336=22.05199 (USD); Case/Package: BGA; Features: UVLO; Height: 5.12mm; Length: 11.176mm; Lifecycle Status: Production; Max Operating Temperature: 125°C; Max Output Voltage: 24V; Min Operating Temperature: -40°C; Min Output Voltage: 2.5V; Mounting Technology: Surface Mount; Pins: 38; Output Current: 450mA; Output Voltage: 2.5V; REACH SVHC: No; Schedule B: 8542390000, 8542390000|8542390000|8542390000|8542390000|8542390000|8542390000|8542390000|8542390000|8542390000|8542390000|8542390000|8542390000|8542390000|8542390000|8542390000|8542390000|8542390000|8542390000|8542390000|8542390000|8542390000|8542390000|8542390000|85; Voltage - Output 1: 24V; Width: 8.89mm; ComponentLink1URL: https://octopart.com:443/opatz8j6/c1?t=Oj7VxIQ7GMteeia82w8ur400d5d9YWHSyo23VKZmy1wmtKx2oGYuni6-gSNXYkZ8IAm8e-uzLb5stTLjxJkUwMRWrNmdhF2sW0UkqgpfCudX4uBQZkZhkiW1Uxx85tVV1a5eIHo_ucwa-F8pDDJepXvtvEekyusXHOtPF_Nf9mZQXVxY0TQbP5Qrr3WnJ8S1V-8Ls7amWVhZPlnsHuBsRP3q5sn294l97LNuuvGS1-QyqMYUqH3we-7Xn3rsFebn7FyvEfeC1bIttu038vEP1V0AUKT82qwIeFNl_0r7T4j_CcF0auD-1g&src-supplier=Analog+Devices; ComponentLink1Description: https://octopart.com:443/opatz8j6/c1?t=Oj7VxIQ7GMteeia82w8ur400d5d9YWHSyo23VKZmy1wmtKx2oGYuni6-gSNXYkZ8IAm8e-uzLb5stTLjxJkUwMRWrNmdhF2sW0UkqgpfCudX4uBQZkZhkiW1Uxx85tVV1a5eIHo_ucwa-F8pDDJepXvtvEekyusXHOtPF_Nf9mZQXVxY0TQbP5Qrr3WnJ8S1V-8Ls7amWVhZPlnsHuBsRP3q5sn294l97LNuuvGS1-QyqMYUqH3we-7Xn3rsFebn7FyvEfeC1bIttu038vEP1V0AUKT82qwIeFNl_0r7T4j_CcF0auD-1g&src-supplier=Analog+Devices; ComponentLink2URL: https://datasheet.octopart.com:443/LTM8067EY%23PBF-Analog-Devices-datasheet-158882019.pdf?src-supplier=element14+APAC; ComponentLink2Description: https://datasheet.octopart.com:443/LTM8067EY%23PBF-Analog-Devices-datasheet-158882019.pdf?src-supplier=element14+APAC; ComponentLink3URL: https://datasheet.octopart.com:443/LTM8067EY%23PBF-Linear-Technology-datasheet-68580100.pdf?src-supplier=element14+APAC; ComponentLink3Description: https://datasheet.octopart.com:443/LTM8067EY%23PBF-Linear-Technology-datasheet-68580100.pdf?src-supplier=element14+APAC; ComponentLink4URL: https://datasheet.octopart.com:443/LTM8067EY%23PBF-Linear-Technology-datasheet-62118201.pdf?src-supplier=element14+APAC; ComponentLink4Description: https://datasheet.octopart.com:443/LTM8067EY%23PBF-Linear-Technology-datasheet-62118201.pdf?src-supplier=element14+APAC; ComponentLink5URL: https://datasheet.octopart.com:443/LTM8067EY%23PBF-Linear-Technology-datasheet-62136742.pdf?src-supplier=element14+APAC; ComponentLink5Description: https://datasheet.octopart.com:443/LTM8067EY%23PBF-Linear-Technology-datasheet-62136742.pdf?src-supplier=element14+APAC; ComponentLink6URL: https://sigma.octopart.com:443/158882018/technical_drawing/Analog-Devices-LTM8067EY%23PBF.pdf?src-supplier=Upverter; ComponentLink6Description: https://sigma.octopart.com:443/158882018/technical_drawing/Analog-Devices-LTM8067EY%23PBF.pdf?src-supplier=Upverter; ComponentLink7URL: https://datasheet.octopart.com:443/LTM8067EY%23PBF-Linear-Technology-datasheet-62332539.pdf?src-supplier=Newark; ComponentLink7Description: https://datasheet.octopart.com:443/LTM8067EY%23PBF-Linear-Technology-datasheet-62332539.pdf?src-supplier=Newark; ComponentLink8URL: https://datasheet.octopart.com:443/LTM8067EY%23PBF-Linear-Technology-datasheet-94100367.pdf?src-supplier=Farnell; ComponentLink8Description: https://datasheet.octopart.com:443/LTM8067EY%23PBF-Linear-Technology-datasheet-94100367.pdf?src-supplier=Farnell; ComponentLink9URL: https://sigma.octopart.com:443/57721882/technical_drawing/Linear-Technology-LTM8067EY%23PBF.pdf?src-supplier=Linear+Technology; ComponentLink9Description: https://sigma.octopart.com:443/57721882/technical_drawing/Linear-Technology-LTM8067EY%23PBF.pdf?src-supplier=Linear+Technology; ComponentLink10URL: http://sigma.octopart.com:80/62332540/materials_sheet/Linear-Technology-LTM8067EY%23PBF.pdf?src-supplier=Compliance+Statements; ComponentLink10Description: http://sigma.octopart.com:80/62332540/materials_sheet/Linear-Technology-LTM8067EY%23PBF.pdf?src-supplier=Compliance+Statements; ComponentLink11URL: http://sigma.octopart.com:80/conflict_mineral_statement/Analog-Devices-company-33.pdf?src-supplier=Compliance+Statements; ComponentLink11Description: http://sigma.octopart.com:80/conflict_mineral_statement/Analog-Devices-company-33.pdf?src-supplier=Compliance+Statements; ComponentLink12URL: http://sigma.octopart.com:80/reach_statement/Maxim-Integrated-company-67.pdf?src-supplier=Compliance+Statements; ComponentLink12Description: http://sigma.octopart.com:80/reach_statement/Maxim-Integrated-company-67.pdf?src-supplier=Compliance+Statements; ComponentLink13URL: http://sigma.octopart.com:80/rohs_statement/Maxim-Integrated-company-66.pdf?src-supplier=Compliance+Statements; ComponentLink13Description: http://sigma.octopart.com:80/rohs_statement/Maxim-Integrated-company-66.pdf?src-supplier=Compliance+Statements; ComponentLink14URL: http://sigma.octopart.com:80/conflict_mineral_statement/Maxim-Integrated-company-65.pdf?src-supplier=Compliance+Statements; ComponentLink14Description: http://sigma.octopart.com:80/conflict_mineral_statement/Maxim-Integrated-company-65.pdf?src-supplier=Compliance+Statements; ComponentLink15URL: https://octopart.com:443/opatz8j6/c1?t=bHLKOnyd-VItur9j0wXZB6CC70wu86RFOAFvVXu9QBmyPqIadUimbHLQ6qo-B5Wfwevq7ESwKSNtgo0PkZU1VGOmf83stHu1LYMOQSByi3lhwDgfDjrxCws4LeoAPbrDnZn6JZHC_OCpBter4_a51jrWzZhifFIcRW99EquOtpLx0WqKIgqXSBtYU7o8Nuhvew2YLscXGBhhpVpgIyctuRZyC7ohwCS0pwHa9LFcPPhgRrbmBwnCkZsl082D6ZpNvPwet3Ck1OxXXrwLXbOuMvjTx3PTMLK6Ru3afttdXdWUZa-ZxEMl2w&src-supplier=Compliance+Statements; ComponentLink15Description: https://octopart.com:443/opatz8j6/c1?t=bHLKOnyd-VItur9j0wXZB6CC70wu86RFOAFvVXu9QBmyPqIadUimbHLQ6qo-B5Wfwevq7ESwKSNtgo0PkZU1VGOmf83stHu1LYMOQSByi3lhwDgfDjrxCws4LeoAPbrDnZn6JZHC_OCpBter4_a51jrWzZhifFIcRW99EquOtpLx0WqKIgqXSBtYU7o8Nuhvew2YLscXGBhhpVpgIyctuRZyC7ohwCS0pwHa9LFcPPhgRrbmBwnCkZsl082D6ZpNvPwet3Ck1OxXXrwLXbOuMvjTx3PTMLK6Ru3afttdXdWUZa-ZxEMl2w&src-supplier=Compliance+Statements
U9 = LTC6909HMS#TRPBF: 1 to 8 Output, Multiphase Silicon Oscillator with Spread Spectrum Modulation; Manufacturer: Analog Devices; Manufacturer Lifecycle Status: PRODUCTION; Frequency: 6.67MHz; Max Junction Temperature (Tj): 150°C; Max Supply Voltage: 5.5V; Min Supply Voltage: 2.7V; Operating Supply Current: 2.4mA; Supplier: DigiKey; Supplier Part Number: 505-LTC6909HMS#TRPBFCT-ND; Manufacturer Part Number: LTC6909HMS#TRPBF; RoHS: Compliant; Category: Oscillators; Stock: 3995; Pricing: 1=11, 10=8.611, 25=8.0136, 100=7.3569, 250=7.04372, 500=6.855, 1000=6.69967 (USD); Case/Package: MSOP; Depth: 3mm; Height: 1.1mm; Lifecycle Status: Production; Max Operating Temperature: 125°C; Min Operating Temperature: -40°C; Mounting Technology: Surface Mount; Pins: 16; Packaging: Tape and Reel; Radiation Hardening: No; ComponentLink1URL: https://octopart.com:443/opatz8j6/c1?t=2IuwlvFjllKfOgG5jKS8YAwu85oRYakGeyqyYYSjhFlqiINRH19AljQdGhE4P9upHd0z2W5WySnulHHjrScDXgB9_qrtM6vdAWTXSwyhkS-zr4ZUiPqTs60pxfAvqnruSsOVK6AUvlsU0AxFslD4zpdlrNgQQgs7913ANkXUmWY7mKDcaernYhfVi7W62vSVk73WBkIOeDjkvdfWcCjdkzYtqA7sv3wtw-Qp-a9CGEWbI2ZpJJrmEN6ExiYkVdCS4-Zk8U7B2fTO5baELiwQjVrMHbDxh4Sft0YsnKbp7UgPFDlcPWjIedI&src-supplier=Analog+Devices; ComponentLink1Description: https://octopart.com:443/opatz8j6/c1?t=2IuwlvFjllKfOgG5jKS8YAwu85oRYakGeyqyYYSjhFlqiINRH19AljQdGhE4P9upHd0z2W5WySnulHHjrScDXgB9_qrtM6vdAWTXSwyhkS-zr4ZUiPqTs60pxfAvqnruSsOVK6AUvlsU0AxFslD4zpdlrNgQQgs7913ANkXUmWY7mKDcaernYhfVi7W62vSVk73WBkIOeDjkvdfWcCjdkzYtqA7sv3wtw-Qp-a9CGEWbI2ZpJJrmEN6ExiYkVdCS4-Zk8U7B2fTO5baELiwQjVrMHbDxh4Sft0YsnKbp7UgPFDlcPWjIedI&src-supplier=Analog+Devices; ComponentLink2URL: https://datasheet.octopart.com:443/LTC6909HMS%23TRPBF-Analog-Devices-datasheet-14357630.pdf?src-supplier=Linear+Technology; ComponentLink2Description: https://datasheet.octopart.com:443/LTC6909HMS%23TRPBF-Analog-Devices-datasheet-14357630.pdf?src-supplier=Linear+Technology; ComponentLink3URL: https://sigma.octopart.com:443/57697106/technical_drawing/Linear-Technology-LTC6909HMS%23TRPBF.pdf?src-supplier=Linear+Technology; ComponentLink3Description: https://sigma.octopart.com:443/57697106/technical_drawing/Linear-Technology-LTC6909HMS%23TRPBF.pdf?src-supplier=Linear+Technology; ComponentLink4URL: https://datasheet.octopart.com:443/LTC6909HMS%23TRPBF-Linear-Technology-datasheet-8832879.pdf?src-supplier=Component+Distributors+Inc.; ComponentLink4Description: https://datasheet.octopart.com:443/LTC6909HMS%23TRPBF-Linear-Technology-datasheet-8832879.pdf?src-supplier=Component+Distributors+Inc.; ComponentLink5URL: http://sigma.octopart.com:80/conflict_mineral_statement/Analog-Devices-company-33.pdf?src-supplier=Compliance+Statements; ComponentLink5Description: http://sigma.octopart.com:80/conflict_mineral_statement/Analog-Devices-company-33.pdf?src-supplier=Compliance+Statements; ComponentLink6URL: https://octopart.com:443/opatz8j6/c1?t=0ts5qc02xJE51n9NaKAJbSNPhd2eNicuhCAhuAX9ZQm8-3cnIP9p4Y4oOcnqsN2rMZQ-x5qlps-1NKFF-nk6klKo8VVU731ermhecZLgxrw5BNqdk3nC47wGbIoxnYj24MiSo4IHDsqqWc7GaZhV83jxeZlht2rN3r1OQFQhPkYWSUhQY1lEPJ1UM5-j4XBbbHu7xEPXQAORXuqDx-c2fVF9Z_cmE0bxApCG2fqYIVrgtyMA25bPjTOik4HdAEwCx66s_cPnJ82lh3yh0JnMeSfdCFZ1GtAqLvnkQO7xjs-6PDZrD4E_1GU&src-supplier=Compliance+Statements; ComponentLink6Description: https://octopart.com:443/opatz8j6/c1?t=0ts5qc02xJE51n9NaKAJbSNPhd2eNicuhCAhuAX9ZQm8-3cnIP9p4Y4oOcnqsN2rMZQ-x5qlps-1NKFF-nk6klKo8VVU731ermhecZLgxrw5BNqdk3nC47wGbIoxnYj24MiSo4IHDsqqWc7GaZhV83jxeZlht2rN3r1OQFQhPkYWSUhQY1lEPJ1UM5-j4XBbbHu7xEPXQAORXuqDx-c2fVF9Z_cmE0bxApCG2fqYIVrgtyMA25bPjTOik4HdAEwCx66s_cPnJ82lh3yh0JnMeSfdCFZ1GtAqLvnkQO7xjs-6PDZrD4E_1GU&src-supplier=Compliance+Statements

## Sheet Phase 1.SchDoc
size Tabloid; SheetNumber: 3; SheetTotal: 7
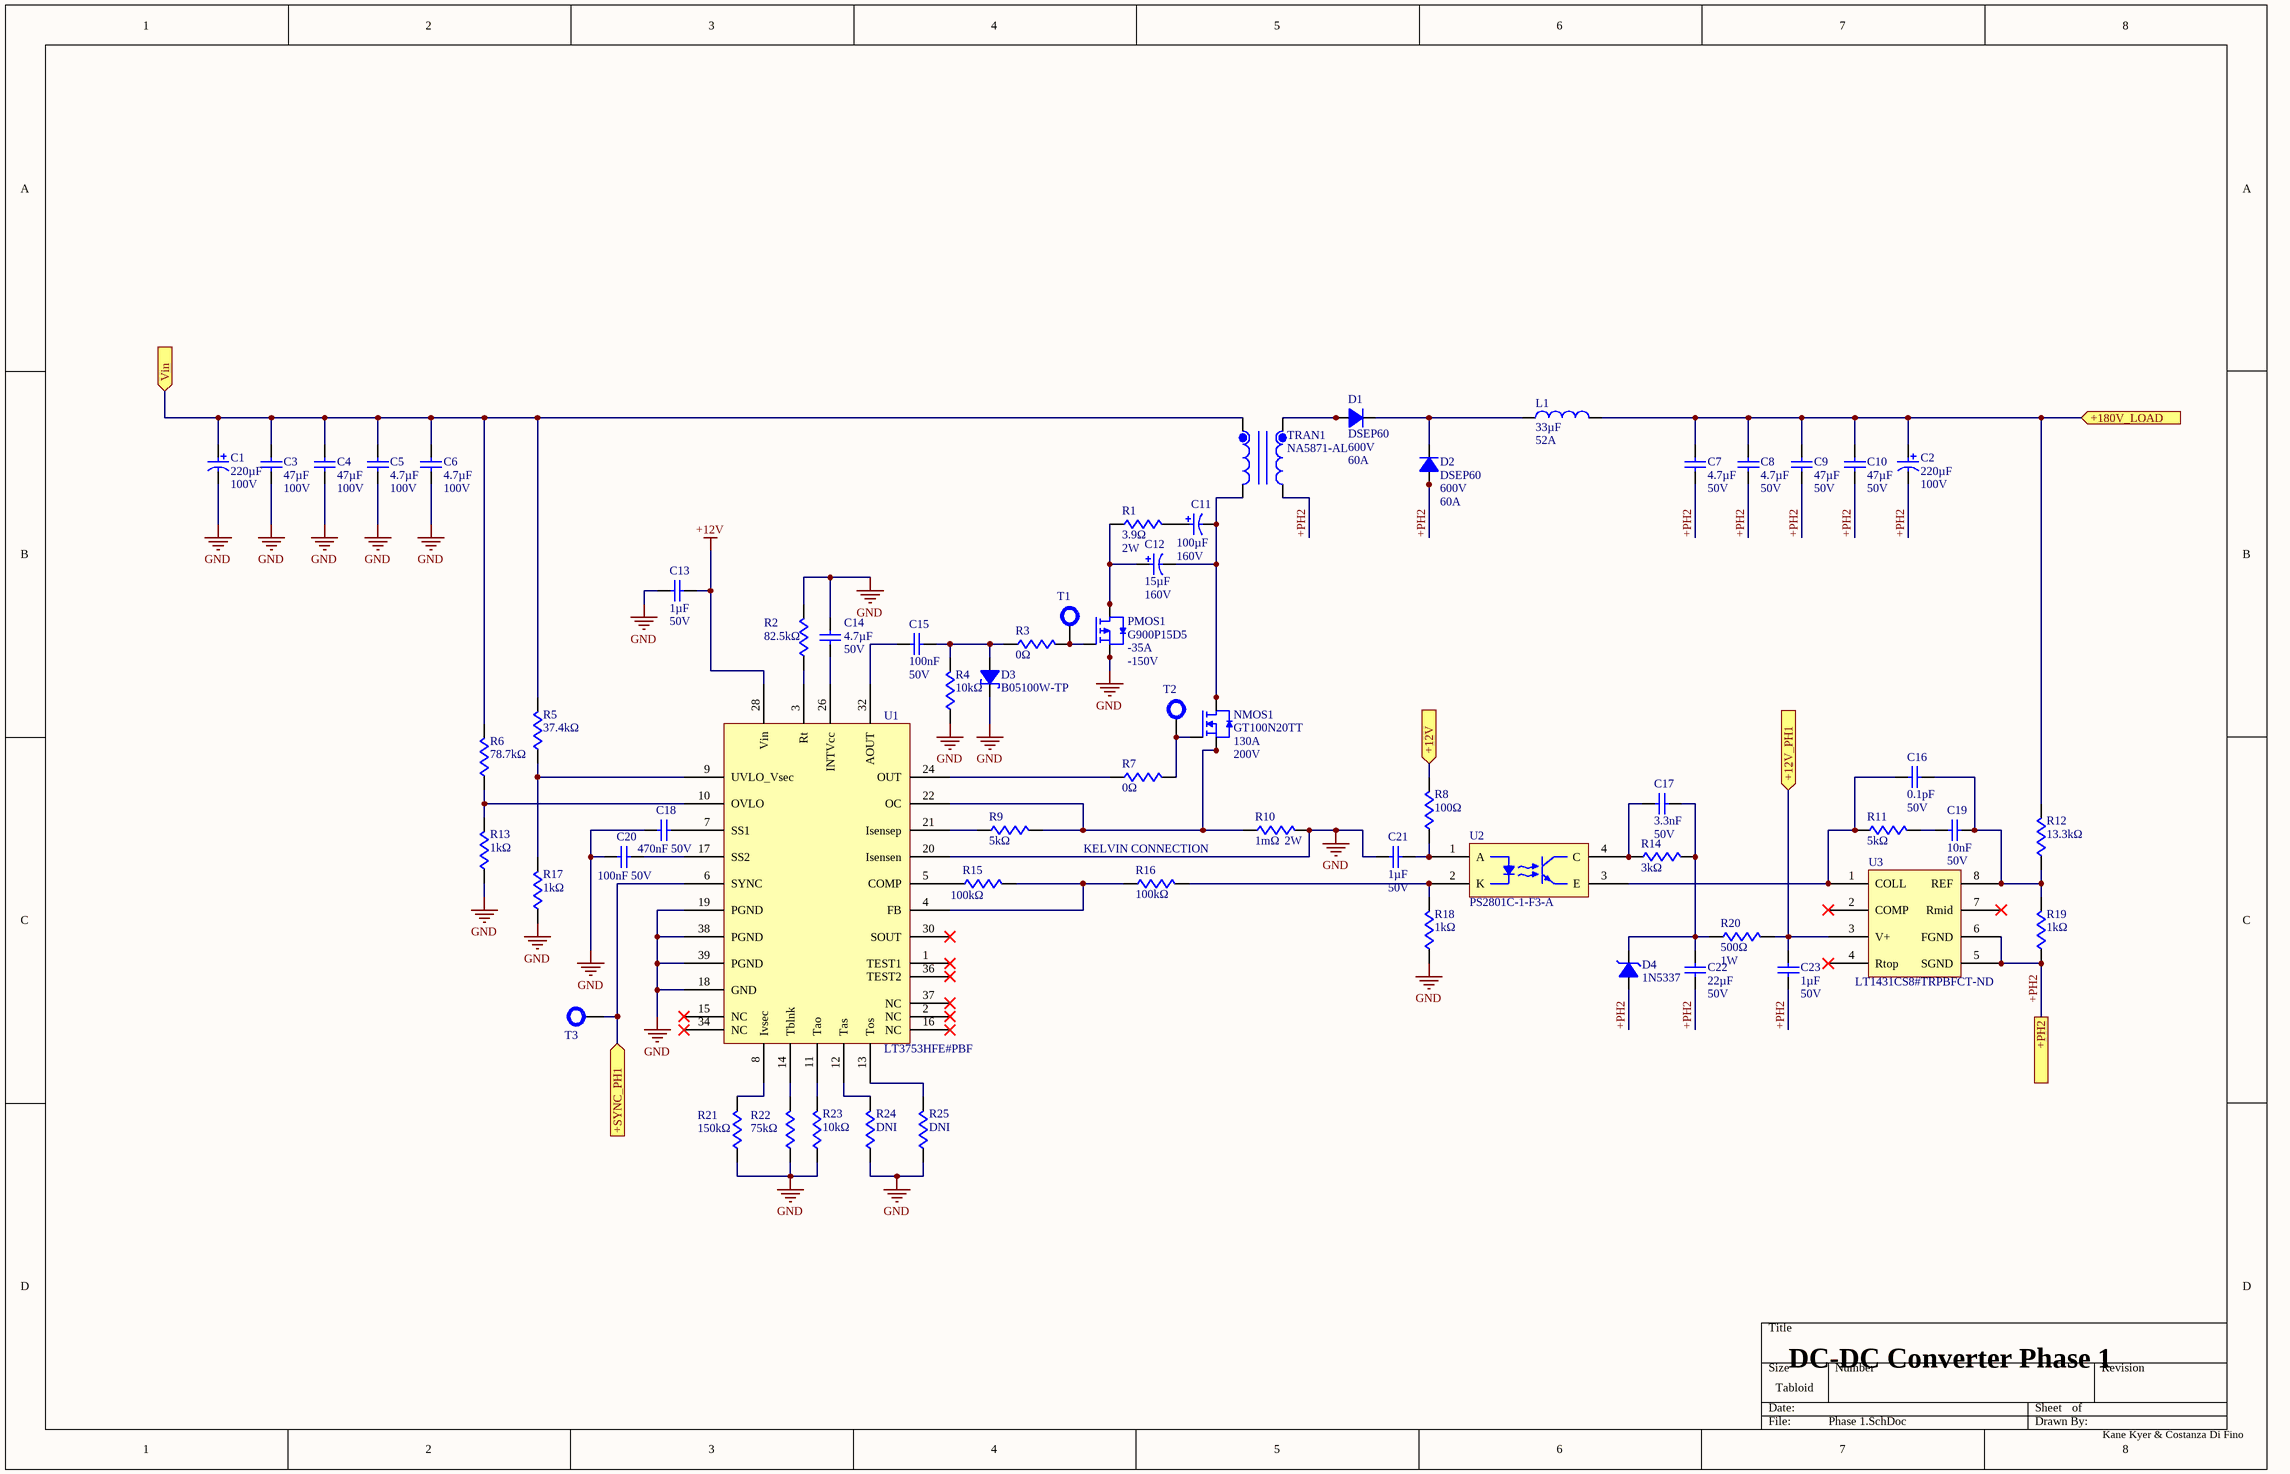
[diagram p2: Phase 1.SchDoc]

### Parts
C1  value 220µF  Voltage Rating: 100V  [C_AEC]  (hidden comment: AFK227M2AR44T-F)
C2  value 220µF  Voltage Rating: 100V  [C_AEC]  (hidden comment: AFK227M2AR44T-F)
C3  value 47µF  Voltage Rating: 100V  [C_CAA573]  (hidden comment: CAA573X7S2A476M640LH)
C4  value 47µF  Voltage Rating: 100V  [C_CAA573]  (hidden comment: CAA573X7S2A476M640LH)
C5  value 4.7µF  Voltage Rating (DC): 100V  [C_1210]  (hidden comment: GMC32X7S475K100NT)
C6  value 4.7µF  Voltage Rating (DC): 100V  [C_1210]  (hidden comment: GMC32X7S475K100NT)
C7  value 4.7µF  Voltage Rating (DC): 50V  [C_1206]  (hidden comment: GMC31X7R475K50NT)
C8  value 4.7µF  Voltage Rating (DC): 50V  [C_1206]  (hidden comment: GMC31X7R475K50NT)
C9  value 47µF  Voltage Rating (DC): 50V  [C_CKG57N]  (hidden comment: CKG57NX7R1H476M500JJ)
C10  value 47µF  Voltage Rating (DC): 50V  [C_CKG57N]  (hidden comment: CKG57NX7R1H476M500JJ)
C11  value 100µF  Voltage Rating (DC): 160V  [UUJ2C101MNJ1MS]  (hidden comment: UUJ2C101MNJ1MS)
C12  value 15µF  Voltage: 160V  [ULT2C150MNL1GS]  (hidden comment: ULT2C150MNL1GS)
C13  value 1µF  Voltage: 50V  [C_0805]  (hidden comment: CL21B105KBFNNNE)
C14  value 4.7µF  Voltage Rating (DC): 50V  [C_1206]  (hidden comment: GMC31X7R475K50NT)
C15  value 100nF  Voltage Rating: 50V  [C_0603]  (hidden comment: C0603C104K5RACTU)
C16  value 0.1pF  Voltage Rating: 50V  [C_0402]  (hidden comment: GJM1555C1HR10WB01D)
C17  value 3.3nF  Voltage Rating: 50V  [C_0603]  (hidden comment: GCM1885C1H332FA16D)
C18  value 470nF  Voltage Rating: 50V  [C_0402]  (hidden comment: GRM155R61H474KE11D)
C19  value 10nF  Voltage Rating: 50V  [C_0603]  (hidden comment: C0603C103K5RACTU)
C20  value 100nF  Voltage Rating: 50V  [C_0603]  (hidden comment: C0603C104K5RACTU)
C21  value 1µF  Voltage: 50V  [C_0805]  (hidden comment: CL21B105KBFNNNE)
C22  value 22µF  Voltage Rating (DC): 50V  [C_2220]  (hidden comment: GMC55X7R226M50NT)
C23  value 1µF  Voltage: 50V  [C_0805]  (hidden comment: CL21B105KBFNNNE)
D1  DSEP60  Vr: 600V  Io: 60A  [D_DSEP60]
D2  DSEP60  Vr: 600V  Io: 60A  [D_DSEP60]
D3  B05100W-TP  [D_B05100W]
D4  Supplier Part Number: 1N5337  [D_1N5337]  (hidden comment: 1N5337BRLG)
L1  value 33µF  Irms: 52A  [CPEX4141L-330MC]  (hidden comment: CPEX4141L-330MC)
NMOS1  Id: 130A  Vds: 200V  [GT100N20TT]  (hidden comment: GT100N20TT)
PMOS1  Id: -35A  Vds: -150V  [G900P15]  (hidden comment: G900P15D5)
R1  value 3.9Ω  Power Rating: 2W  [R_SM2W]  (hidden comment: SMW23R9JT)
R2  value 82.5kΩ  [R_0805]  (hidden comment: RMCF0805FT82K5)
R3  value 0Ω  [R_0805]  (hidden comment: CRCW08050000Z0EA)
R4  value 10kΩ  [R_0402]  (hidden comment: RM04F1002CT)
R5  value 37.4kΩ  [R_0603]  (hidden comment: RC0603FR-0737K4L)
R6  value 78.7kΩ  [R_0603]  (hidden comment: RC0603FR-0778K7L)
R7  value 0Ω  [R_0805]  (hidden comment: CRCW08050000Z0EA)
R8  value 100Ω  [R_0603]  (hidden comment: RC0603FR-07100RL)
R9  value 5kΩ  [R_0402]  (hidden comment: PNM0402E5001BST1)
R10  value 1mΩ  Power Rating: 2W  [R_2512]  (hidden comment: CRE2512-FZ-R001E-2)
R11  value 5kΩ  [R_0402]  (hidden comment: PNM0402E5001BST1)
R12  value 13.3kΩ  [R_0603]  (hidden comment: RMCF0603FT13K3)
R13  value 1kΩ  [R_0402]  (hidden comment: RM04F1001CT)
R14  value 3kΩ  [C_0402]  (hidden comment: AC0402FR-073KL)
R15  value 100kΩ  [R_0402]  (hidden comment: RM04F1003CT)
R16  value 100kΩ  [R_0402]  (hidden comment: RM04F1003CT)
R17  value 1kΩ  [R_0402]  (hidden comment: RM04F1001CT)
R18  value 1kΩ  [R_0402]  (hidden comment: RM04F1001CT)
R19  value 1kΩ  [R_0402]  (hidden comment: RM04F1001CT)
R20  value 500Ω  Power Rating: 1W  [R_WSC2515]  (hidden comment: WSC2515500R0FEB)
R21  value 150kΩ  [R_0603]  (hidden comment: RC0603FR-07150KL)
R22  value 75kΩ  [R_0603]  (hidden comment: AC0603FR-0775KL)
R23  value 10kΩ  [R_0402]  (hidden comment: RM04F1002CT)
R24  value DNI  [R_0805]  (hidden comment: CRCW08050000Z0EA)
R25  value DNI  [R_0805]  (hidden comment: CRCW08050000Z0EA)
T1  TEST  [TEST_POINT]  (value not drawn)
T2  TEST  [TEST_POINT]  (value not drawn)
T3  TEST  [TEST_POINT]  (value not drawn)
TRAN1  NA5871-AL  [NA5871-AL]
U1  LT3753HFE#PBF  [LT3753]
U2  PS2801C-1-F3-A  [PS2801C]
U3  Supplier Part Number: LT1431CS8#TRPBFCT-ND  [LT1431]  (hidden comment: LT1431CS8#TRPBF)